# Altium schematic sheet RELAY8.SchDoc
size A
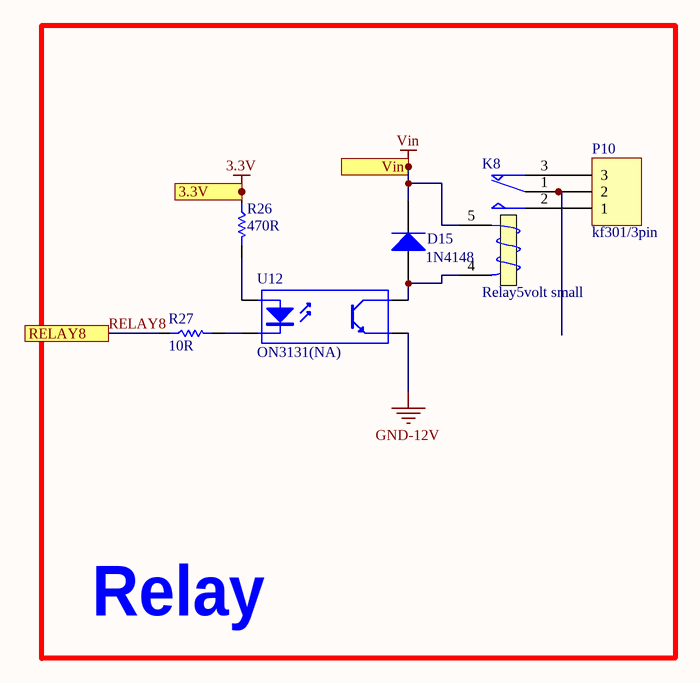
[diagram p0: RELAY8.SchDoc]

## Parts
D15  1N4148  [sod123]
K8  Relay5volt small  [relay5_childern]
P10  kf301/3pin  [Blue Connector 1*3 -kf301]
R26  470R  [0805/resistor]
R27  10R  [0805/resistor]
U12  ON3131(NA)  [OPTO_COUPLER]

## Blocks framed on the sheet
Relay: D15 K8 P10 R26 R27 U12

## Ports
3.3V, RELAY8, Vin

## Nets
3.3V: R26.1 ; port 3.3V
GND-12V: U12.3(E)
Vin: D15.K K8.5 ; port Vin
RELAY8: R27.1 ; port RELAY8
NetD15_A: D15.A K8.4(T2) U12.4(C)
NetK8_1: K8.1(COM) P10.2
NetK8_2: K8.2(NO) P10.1
NetK8_3: K8.3(T1) P10.3
NetR26_2: R26.2 U12.1(A)
NetR27_2: R27.2 U12.2(K)

## Library data of the parts
D15 = Diode 1N4007: 1 Amp General Purpose Rectifier; Published: 8-Jun-2000; LatestRevisionDate: 17-Jul-2002; LatestRevisionNote: Re-released for DXP Platform.; DatasheetVersion: 1998; PackageVersion: Aug-1999; PackageReference: DO-41; Publisher: Altium Limited; PackageDescription: Diode, Axial; Body 5.2 x 2.7 mm (LxDia. max), Lead Dia. 0.86 mm (max); Code_JEDEC: DO-204-AL; ComponentLink1Description: Manufacturer Link; ComponentLink1URL: http://www.fairchildsemi.com/; ComponentLink2Description: Datasheet; ComponentLink2URL: http://www.fairchildsemi.com/ds/1N%2F1N4001.pdf
K8 = Relay: SPDT Relay; Published: 8-Jun-2000; LatestRevisionDate: 17-Jul-2002; LatestRevisionNote: Re-released for DXP Platform.; PackageReference: MODULE5B; Publisher: Altium Limited
P10 = Header 3: LatestRevisionDate: 17-Jul-2002; LatestRevisionNote: Re-released for DXP Platform.; Publisher: Altium Limited
R26 R27 = Resistor: Tolerance: 5%; Power: 1/8 W
  R26: Value: 470R
  R27: Value: 10R
U12 = Optoisolator1: 4-Pin Phototransistor Optocoupler; Published: 24-Mar-1999; LatestRevisionDate: 04-Mar-2005; LatestRevisionNote: Sch pins 3 & 4 Swapped.; DatasheetVersion: Nov-2003; PackageReference: DIP-4; Publisher: Altium Limited